# EAGLE design linear-led-driver (EAGLE 5.11)
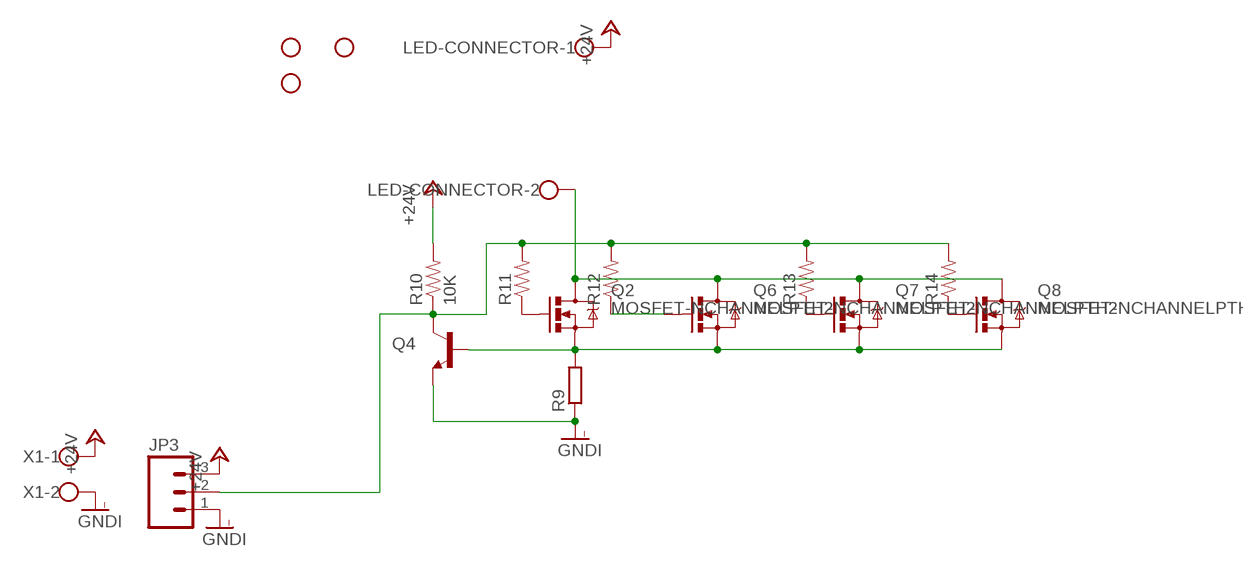
[diagram p0: schematic, sheet 1]

## Parts
JP3  M03LONGPADS  [1X03_LONGPADS]
JP4  STAND-OFF  [STAND-OFF]
JP5  STAND-OFF  [STAND-OFF]
JP7  STAND-OFF  [STAND-OFF]
LED-CONNECTOR  W237-102  [W237-102]
Q2  MOSFET-NCHANNELPTH2  [TO220V]
Q4  TRANSISTOR_NPNSOT23  [SOT23]
Q6  MOSFET-NCHANNELPTH2  [TO220V]
Q7  MOSFET-NCHANNELPTH2  [TO220V]
Q8  MOSFET-NCHANNELPTH2  [TO220V]
R9  R-EU_VTA52  [VTA52]
R10  10K  RESISTOR0805-RES  [0805]
R11  RESISTOR0805-RES  [0805]
R12  RESISTOR0805-RES  [0805]
R13  RESISTOR0805-RES  [0805]
R14  RESISTOR0805-RES  [0805]
X1  W237-102  [W237-102]

## Nets
+24V: JP3.3 LED-CONNECTOR.1 R10.2 X1.1
GNDI: JP3.1 Q4.2(E) R9.1 X1.2
LEDS: LED-CONNECTOR.2 Q2.2(D) Q6.2(D) Q7.2(D) Q8.2(D)
LIMIT: JP3.2 Q4.3(C) R10.1 R11.2 R12.2 R13.2 R14.2
N$10: Q2.1(G) R11.1
N$13: Q6.1(G) R12.1
N$27: Q7.1(G) R13.1
N$29: Q8.1(G) R14.1
SENSE: Q2.3(S) Q4.1(B) Q6.3(S) Q7.3(S) Q8.3(S) R9.2

## Library data of the parts
JP3 = SparkFun:M03: Header 3 Standard 3-pin 0.1" header. Use with straight break away headers (SKU : PRT-00116), right angle break away headers (PRT-00553), swiss pins (PRT-00743), machine pins (PRT-00117), and female headers (PRT-00115). Molex polarized connector foot print use with SKU : PRT-08232 with associated crimp pins and housings.
JP4 JP5 JP7 = SparkFun:STAND-OFF: Stand Off This is the mechanical footprint for a #4 phillips button head screw. Use the keepout ring to avoid running the screw head into surrounding components. SKU : PRT-00447
LED-CONNECTOR X1 = con-wago-500:W237-102: WAGO SCREW CLAMP; MPN: 237-102; OC_FARNELL: unknown; OC_NEWARK: 70K9898
Q2 Q6-Q8 = SparkFun:MOSFET-NCHANNEL
Q4 = SparkFun:TRANSISTOR_NPN: Transistor NPN BJT configuration in SOT23 package. MMBT2222 is the common NPN we use. Double check BCE configuration again layout.
R9 = rcl:R-EU_: RESISTOR, European symbol
R10-R14 = SparkFun:RESISTOR: Resistor Basic schematic elements and footprints for 0603, 1206, and PTH resistors.

## Board
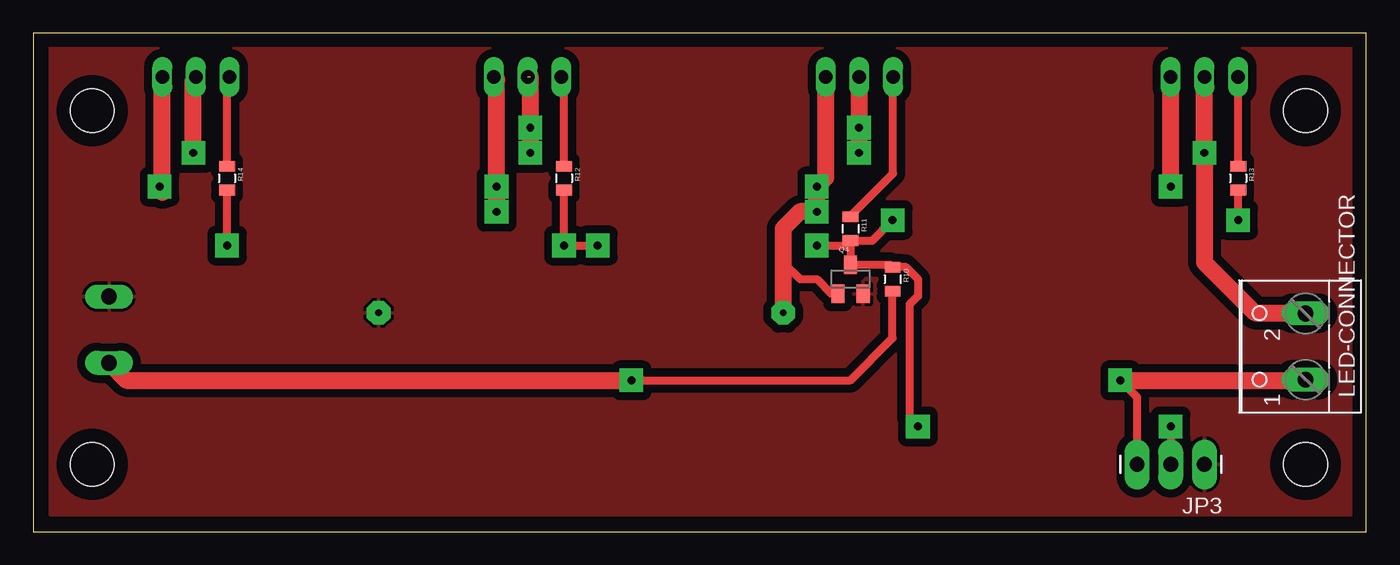
[diagram p1: board, top side]
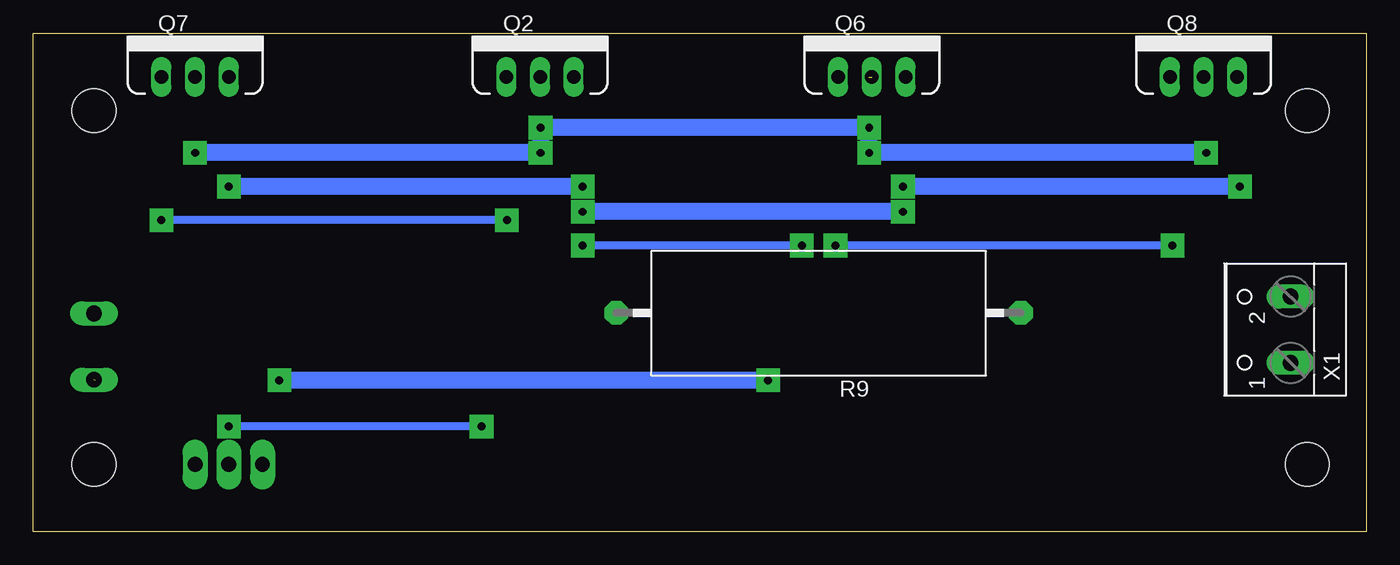
[diagram p2: board, bottom side, seen from below]

Size 100.47 x 37.6 mm. Coordinates in mm from the lower left corner, seen from the top.
Outline: 0,0 100.47,0 100.47,37.6 0,37.6 0,0
Copper layers (1*16): Top 0.035mm / dielectric 1.5mm / Bottom 0.035mm
Design rules "default": minimum track width 10mil, minimum drill 24mil, track to track 8mil, track to pad 8mil, pad to pad 8mil, via to via 8mil, smd to smd 8mil, copper to edge 40mil, drill to drill 8mil, minimum pad ring 10mil, minimum via ring 8mil, stop-mask expansion 4mil, vias tented up to drill 0mil, thermal gap 10mil

### Footprints (pad centres in the part's own frame; a part is rotated, then mirrored left to right if it is on the bottom)
1X03_LONGPADS = drill 1.118 pad 1.88 long: 1 0,0; 2 2.54,0; 3 5.08,0
STAND-OFF = hole 3.302: 0,0
W237-102 = drill 1.194 long: 1 -2.5,-1.27; 2 2.5,-1.27
TO220V = drill 1.016 long: 1 -2.54,0; 2 0,0; 3 2.54,0
SOT23 = smd 1 x 1.4: 1 -0.95,-1.1; 2 0.95,-1.1; 3 0,1.1
VTA52 = drill 0.5 pad 1.778 octagon: 1 -15.24,0; 2 15.24,0
0805 = smd 0.8 x 1.2: 1 -0.9,0; 2 0.9,0

### Placement (x,y rotation side)
JP3  88.27,5.08 180 top
JP4  4.44,31.75 0 top
JP5  4.44,5.08 0 top
JP7  95.89,5.08 0 top
JP10  STAND-OFF  [STAND-OFF]  95.89,31.75 0 top
LED-CONNECTOR  94.61,13.97 90 top
Q2  62.27,34.29 0 bottom
Q4  61.59,19.05 0 top
Q6  37.27,34.29 0 bottom
Q7  88.27,34.29 0 bottom
Q8  12.27,34.29 0 bottom
R9  41.27,16.51 180 bottom
R10  64.77,19.05 270 top
R11  61.59,22.86 270 top
R12  40,26.67 270 top
R13  90.8,26.67 270 top
R14  14.61,26.67 270 top
X1  6.99,15.24 90 bottom

### Tracks (layer width: path | path; a pad name or v marks a point on that pad's centre or on a via)
+24V  (via drill 0.6 pad 1.78)  (1 unrouted)
  Top 0.61: JP3.3 83.19,10.16 v81.91,11.43 | R10.2 64.77,14.6 61.59,11.43 v45.09,11.43
  Top 1.27: v81.91,11.43 95.78,11.43 | v45.09,11.43 7.02,11.43 X1.1
  Bottom 1.27: v45.09,11.43 v81.91,11.43
GNDI
  pour Top (isolate 0.61): 1.27,36.83 99.69,36.83 99.69,1.27 1.27,1.27
LEDS  (via drill 0.6 pad 1.78)  (1 unrouted)
  Top 0.406: 94.61,16.51 95.89,16.51 LED-CONNECTOR.2
  Top 1.27: 37.46,34.29 v37.46,30.48 v37.46,28.57 | Q2.2 62.27,31.08 v62.23,30.48 v62.23,28.57 | Q7.2 v88.27,28.57 88.27,20.32 92.08,16.51 94.61,16.51 | v12.07,28.57 12.07,34.09 Q8.2
  Bottom 1.27: v12.07,28.57 v37.46,28.57 v37.46,30.48 v62.23,30.48 v62.23,28.57 v88.27,28.57
LIMIT  (via drill 0.6 pad 1.78)
  Top 0.61: R12.2 v40,21.59 v42.55,21.59 | v14.61,21.59 R14.2 | v90.8,23.49 R13.2 | v85.72,7.94 JP3.2 | R11.2 61.23,21.59 v59.05,21.59 | R11.2 63.23,21.96 v64.77,23.49 | R11.2 Q4.3 64.57,20.15 R10.1 64.82,20 65.72,20 66.67,19.05 66.67,17.78 66.04,17.14 66.04,8.57 v66.67,7.94
  Bottom 0.61: v14.61,21.59 v40,21.59 | v64.77,23.49 v90.8,23.49 | v42.55,21.59 v59.05,21.59 | v66.67,7.94 v85.72,7.94
N$10
  Top 0.61: R11.1 61.59,23.81 64.8,27.02 Q2.1
N$13
  Top 0.61: R12.1 40,34.09 Q6.1
N$27
  Top 0.61: R13.1 Q7.1
N$29
  Top 0.61: R14.1 14.61,34.09 Q8.1
SENSE  (via drill 0.6 pad 1.78)
  Top 0.61: Q4.1 60.16,17.95 59.05,19.05 57.78,19.05 56.52,20.32
  Top 1.27: Q8.3 9.73,25.6 v9.53,26.03 | Q6.3 34.92,34.09 v34.92,26.03 v34.92,24.13 | Q2.3 59.73,26.7 v59.05,26.03 v59.05,24.13 57.78,24.13 56.52,22.86 56.52,20.32 R9.2 | v85.72,26.03 Q7.3
  Bottom 1.27: v9.53,26.03 v34.92,26.03 | v59.05,26.03 v85.72,26.03 | v34.92,24.13 v59.05,24.13